# Altium project GreenHouse-hwd.PrjPcb (part 2 of 2)

## Sheet 11-LedIndicators.SchDoc
size A4; Author: Fabian Castaño; CompanyName: UdeA; Engineer: Fabian Castaño; Organization: Universidad de Antioquia; Address1: UdeA; Address2: Medellín; Address3: Antioquia; Address4: Colombia 050010; DocumentNumber: 12; SheetNumber: 12; SheetTotal: 12
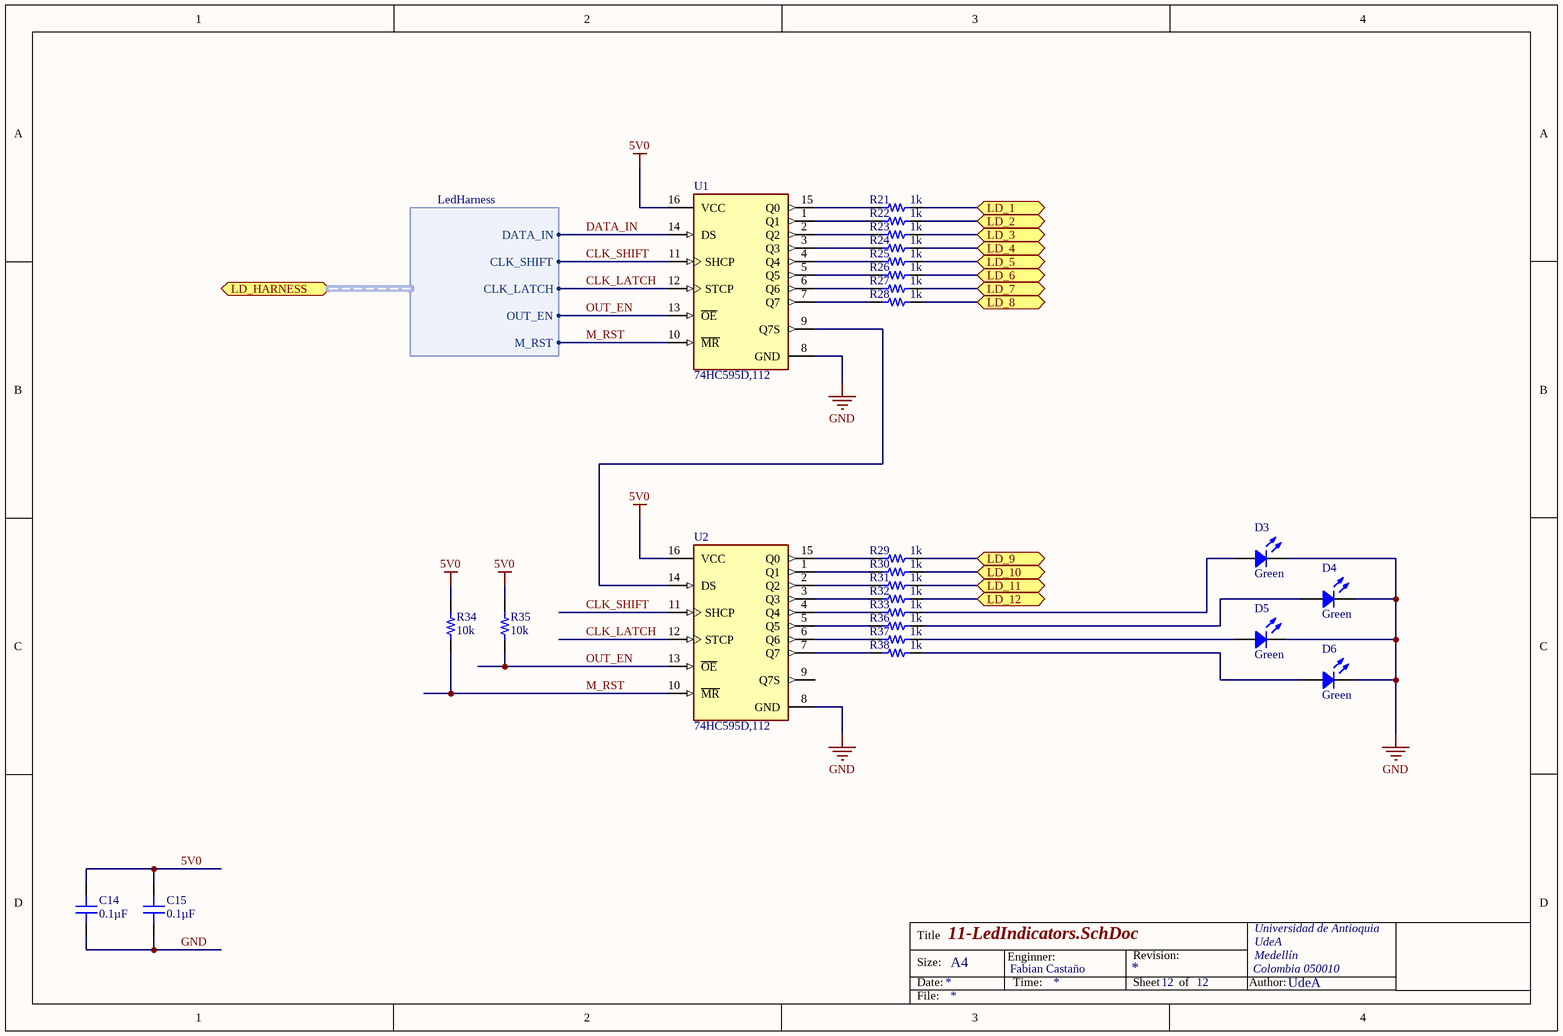
[diagram p11: 11-LedIndicators.SchDoc]

### Parts
C14  0.1µF  [CAP 0805_2012]
C15  0.1µF  [CAP 0805_2012]
D3  Green  [LED 0805_2012 YELLOW]
D4  Green  [LED 0805_2012 YELLOW]
D5  Green  [LED 0805_2012 YELLOW]
D6  Green  [LED 0805_2012 YELLOW]
R21  1k  [RES 0805_2012]
R22  1k  [RES 0805_2012]
R23  1k  [RES 0805_2012]
R24  1k  [RES 0805_2012]
R25  1k  [RES 0805_2012]
R26  1k  [RES 0805_2012]
R27  1k  [RES 0805_2012]
R28  1k  [RES 0805_2012]
R29  1k  [RES 0805_2012]
R30  1k  [RES 0805_2012]
R31  1k  [RES 0805_2012]
R32  1k  [RES 0805_2012]
R33  1k  [RES 0805_2012]
R34  10k  [RES 0805_2012]
R35  10k  [RES 0805_2012]
R36  1k  [RES 0805_2012]
R37  1k  [RES 0805_2012]
R38  1k  [RES 0805_2012]
U1  74HC595D,112  [FP-SOT109-1-MFG]
U2  74HC595D,112  [FP-SOT109-1-MFG]

### Ports
LD_1 (bidir), LD_2 (bidir), LD_3 (bidir), LD_4 (bidir), LD_5 (bidir), LD_6 (bidir), LD_7 (bidir), LD_8 (bidir), LD_9 (bidir), LD_10 (bidir), LD_11 (bidir), LD_12 (bidir), LD_HARNESS (harness LedHarness)

### Harnesses
LedHarness: DATA_IN, CLK_SHIFT, CLK_LATCH, OUT_EN, M_RST

### Nets
5V0: C14.2 C15.2 R34.2 R35.2 U1.16(VCC) U2.16(VCC)
GND: C14.1 C15.1 D3.2 D4.2 D5.2 D6.2 U1.8(GND) U2.8(GND)
CLK_LATCH: U1.12(STCP) U2.12(STCP) ; port LD_HARNESS.CLK_LATCH
CLK_SHIFT: U1.11(SHCP) U2.11(SHCP) ; port LD_HARNESS.CLK_SHIFT
DATA_IN: U1.14(DS) ; port LD_HARNESS.DATA_IN
M_RST: R34.1 U1.10(~{MR}) U2.10(~{MR}) ; port LD_HARNESS.M_RST
OUT_EN: R35.1 U1.13(~{OE}) U2.13(~{OE}) ; port LD_HARNESS.OUT_EN
NetD3_1: D3.1 R33.1
NetD4_1: D4.1 R36.1
NetD5_1: D5.1 R37.1
NetD6_1: D6.1 R38.1
NetJ1_10: R32.1 ; port LD_12
NetJ1_12: R31.1 ; port LD_11
NetJ2_10: R30.1 ; port LD_10
NetJ2_12: R29.1 ; port LD_9
NetJ3_10: R28.1 ; port LD_8
NetJ3_12: R27.1 ; port LD_7
NetJ5_10: R24.1 ; port LD_4
NetJ5_12: R23.1 ; port LD_3
NetJ6_10: R26.1 ; port LD_6
NetJ6_12: R25.1 ; port LD_5
NetJ8_10: R22.1 ; port LD_2
NetJ8_12: R21.1 ; port LD_1
NetR21_2: R21.2 U1.15(Q0)
NetR22_2: R22.2 U1.1(Q1)
NetR23_2: R23.2 U1.2(Q2)
NetR24_2: R24.2 U1.3(Q3)
NetR25_2: R25.2 U1.4(Q4)
NetR26_2: R26.2 U1.5(Q5)
NetR27_2: R27.2 U1.6(Q6)
NetR28_2: R28.2 U1.7(Q7)
NetR29_2: R29.2 U2.15(Q0)
NetR30_2: R30.2 U2.1(Q1)
NetR31_2: R31.2 U2.2(Q2)
NetR32_2: R32.2 U2.3(Q3)
NetR33_2: R33.2 U2.4(Q4)
NetR36_2: R36.2 U2.5(Q5)
NetR37_2: R37.2 U2.6(Q6)
NetR38_2: R38.2 U2.7(Q7)
NetU1_9: U1.9(Q7S) U2.14(DS)

Not connected (* = marked no-connect by the designer): U2 9(Q7S)

### Notes on the sheet
- Title
- Size:
- Date:
- A4
- Enginner:
- Time:
- Revision:
- Sheet
- of
- Author:
- File:

### Library data of the parts
C14 C15 = C0805C104M5RACAUTO: CAP CER 0.1UF 50V X7R 0805; Manufacturer: KEMET; Tolerance: ±20%; Part Number: C0805C104M5RACAUTO; Value: 0.1µF; Applications: Automotive, Bypass, Decoupling; Capacitance: 0.1µF; ComponentLink1Description: Datasheet; ComponentLink1URL: https://api.kemet.com/component-edge/download/datasheet/C0805C104M5RACAUTO.pdf; ComponentLink2Description: DigiKey Link; ComponentLink2URL: http://digikey.com/product-detail/en/kemet/C0805C104M5RACAUTO/399-12977-1-ND/5762259; Device Package: 0805 (2012 Metric); LastUpdated: 2/09/2020 01:04:42; Lifecycle Status: Active; Minimum Order: 1; Mounting Type: Surface Mount, MLCC; Operating Temperature: -55°C ~ 125°C; Package / Case: 0805 (2012 Metric); Packaging: TapeAndReel; PartId: 2568; Part Status: Active; Price: 0.02; Ratings: AEC-Q200; Series: SMD Auto X7R; Size / Dimension: 0.079" L x 0.049" W (2.00mm x 1.25mm); Supplier 1: DigiKey; Supplier Part Number 1: 399-12977-1-ND; Temperature Coefficient: X7R; Thickness (Max): 0.035" (0.88mm); Voltage - Rated: 50V
D3-D6 = APT2012SYCK: LED YELLOW CLEAR CHIP SMD; Manufacturer: Kingbright; Configuration: Standard; Current - Test: 20mA; Lens Color: Colorless; Lens Size: 1.30mm x 1.25mm; Lens Style: Rectangle with Flat Top; Millicandela Rating: 150mcd; Viewing Angle: 120°; Voltage - Forward (Vf) (Typ): 2V; Wavelength - Dominant: 590nm; Part Number: APT2012SYCK; Color: Yellow; ComponentLink1Description: Datasheet; ComponentLink1URL: http://www.kingbrightusa.com/images/catalog/SPEC/APT2012SYCK.pdf; ComponentLink2Description: DigiKey Link; ComponentLink2URL: https://www.digikey.com/en/products/detail/kingbright/APT2012SYCK/1747533; Device Package: 0805 (2012 Metric); Height (Max): 0.75mm; LastUpdated: 12/04/2022 10:52:50 p. m.; Lens Transparency: Clear; Lifecycle Status: Active; Minimum Order: 1; Mounting Type: Surface Mount; Package / Case: 0805 (2012 Metric); Packaging: TapeAndReel; PartId: 47; Part Status: Active; Price: 0.05; Series: -; Size / Dimension: 2.00mm L x 1.25mm W; Supplier 1: DigiKey; Supplier Part Number 1: 754-1134-1-ND; Supplier Device Package: Chip LED; Value: Green; Wavelength - Peak: 590nm
R21-R38 = RC0805FR-071K47L: RES SMD 1.47K OHM 1% 1/8W 0805; Manufacturer: Yageo; Power (Watts): 0.125W, 1/8W; Resistance: 1.47 kOhms; Temperature Coefficient: ±100ppm/°C; Part Number: RC0805FR-071K47L; ComponentLink1Description: Datasheet; ComponentLink1URL: https://www.yageo.com/upload/media/product/productsearch/datasheet/rchip/PYu-RC_Group_51_RoHS_L_10.pdf; ComponentLink2Description: DigiKey Link; ComponentLink2URL: http://digikey.com/product-detail/en/yageo/RC0805FR-071K47L/311-1.47KCRCT-ND/730440; Composition: Thick Film; Device Package: 0805 (2012 Metric); Features: Moisture Resistant; Height - Seated (Max): 0.024" (0.60mm); LastUpdated: 2/09/2020 01:14:46; Lifecycle Status: Active; Minimum Order: 1; Number of Terminations: 2; Operating Temperature: -55°C ~ 155°C; Package / Case: 0805 (2012 Metric); Packaging: CutTape; PartId: 44768; Part Status: Active; Price: 0.10; Series: RC; Size / Dimension: 0.079" L x 0.049" W (2.00mm x 1.25mm); Supplier 1: DigiKey; Supplier Part Number 1: 311-1.47KCRCT-ND; Supplier Device Package: 0805; Tolerance: ±1%
  R21-R33 R36-R38: Value: 1k
  R34 R35: Value: 10k
U1 U2 = CMP-14351-000003-1: IC SHIFT REGISTER 8BIT 16SOIC; Manufacturer: Nexperia; Propagation Delay: 16ns; Number Of Circuits: 1; Min Supply Voltage: 2V; Nominal Supply Current: 70mA; Standoff Height: 0.1mm; Frequency: 108MHz; Max Supply Voltage: 6V; Number Of Outputs: 8; Ambient Temperature Range Low: -40°C; ComponentLink2Description: Datasheet; Temperature Range High: +125°C; Temperature Range Low: -40°C; Octopart: https://octopart.com/74hc595d%2C112-nexperia-78737374; Category: IC; Automotive: No; Digikey Description: IC SHIFT REGISTER 8BIT 16SOIC; Footprint Url: https://assets.nexperia.com/documents/outline-drawing/SOT109-1.pdf; Device Class L3: Shift Registers; Package: SOT109-1; Device Class L2: Logic ICs; Lead Free: Yes; Device Class L1: Integrated Circuits (ICs); Manufacturer Part Number: 74HC595D,112; ComponentLink2URL: https://assets.nexperia.com/documents/data-sheet/74HC_HCT595.pdf; Height: 1.75mm; Ambient Temperature Range High: +125°C; RoHS: TRUE; Number Of Inputs: 1; Temperature: -40°C to +125°C; Mouser Description: 74HC(T)595 - 8-bit serial-in, serial or parallel-out shift register with output latches; 3-state

## Nets that join several sheets
3V3: 1-Microcontroller (MD1.62), 5-ThermoHygroSensor (R9.2)
5V0: 0-Hierarchy (6 pins), 1-Microcontroller (MD1.61 MD1.82 MD1.83), HS11 (R3_HS11.2), HS12 (R3_HS12.2), HS13 (R3_HS13.2), HS14 (R3_HS14.2), 4-LightSensor (R5.2), 5-ThermoHygroSensor (J5.7 R7.2 R8.2), 6-AirQualitySensor (R10.1 R10.2), 7-WeightSensor (C10.2 J6.7), T1W1 (R16_T1W1.2), T1W2 (R16_T1W2.2), 10-AdditionalSensors (C11.2 J8.7 R19.2 R20.2), 11-LedIndicators (6 pins)
GND: 0-Hierarchy (13 pins), 1-Microcontroller (5 pins), HS11 (R4_HS11.1), HS12 (R4_HS12.1), HS13 (R4_HS13.1), HS14 (R4_HS14.1), 4-LightSensor (R6.1), 5-ThermoHygroSensor (J5.6 J5.8 J5.9 J5.11), 6-AirQualitySensor (C7.1 R11.1 R12.1 R12.2), VALV1 (5 pins), VALV2 (5 pins), 7-WeightSensor (5 pins), 10-AdditionalSensors (C11.1 J8.8 J8.9 J8.11), 11-LedIndicators (8 pins)
V_Valve: 0-Hierarchy (J4.1 R1.1 R2.1), VALV1 (C8_VALV1.2 C9_VALV1.1 D1_VALV1.2 R13_VALV1.2), VALV2 (C8_VALV2.2 C9_VALV2.1 D1_VALV2.2 R13_VALV2.2)
VIN: 0-Hierarchy (R1.2 R2.2), 1-Microcontroller (MD1.58)
AQS_1: 0-Hierarchy (J2.4 J2.5), 1-Microcontroller (MD1.69), 6-AirQualitySensor (C7.2 R11.2)
CLK_LATCH: 1-Microcontroller (MD1.32), 11-LedIndicators (U1.12 U2.12)
CLK_SHIFT: 1-Microcontroller (MD1.31), 11-LedIndicators (U1.11 U2.11)
DATA_IN: 1-Microcontroller (MD1.30), 11-LedIndicators (U1.14)
FS_1: 1-Microcontroller (MD1.9), FS11 (R18_FS11.1)
FS_2: 1-Microcontroller (MD1.25), FS12 (R18_FS12.1)
H_IN_N_1: 0-Hierarchy (J1.2), HS11 (C5_HS11.1 R4_HS11.2)
H_IN_N_2: 0-Hierarchy (J1.6), HS12 (C5_HS12.1 R4_HS12.2)
H_IN_N_3: 0-Hierarchy (J1.4), HS13 (C5_HS13.1 R4_HS13.2)
H_IN_N_4: 0-Hierarchy (J1.8), HS14 (C5_HS14.1 R4_HS14.2)
H_IN_P_1: 0-Hierarchy (J1.1), 1-Microcontroller (MD1.66), HS11 (C5_HS11.2 R3_HS11.1)
H_IN_P_2: 0-Hierarchy (J1.3), 1-Microcontroller (MD1.67), HS12 (C5_HS12.2 R3_HS12.1)
H_IN_P_3: 0-Hierarchy (J1.5), 1-Microcontroller (MD1.72), HS13 (C5_HS13.2 R3_HS13.1)
H_IN_P_4: 0-Hierarchy (J1.7), 1-Microcontroller (MD1.73), HS14 (C5_HS14.2 R3_HS14.1)
HALL_E_1: 0-Hierarchy (J3.5), FS11 (R18_FS11.2)
HALL_E_2: 0-Hierarchy (J3.4), FS12 (R18_FS12.2)
L_IN_N: 0-Hierarchy (J2.2), 4-LightSensor (C6.1 R6.2)
L_IN_P: 0-Hierarchy (J2.1), 1-Microcontroller (MD1.68), 4-LightSensor (C6.2 R5.1)
M_RST: 1-Microcontroller (MD1.34), 11-LedIndicators (R34.1 U1.10 U2.10)
NetJ1_10: 0-Hierarchy (J1.10), 11-LedIndicators (R32.1)
NetJ1_12: 0-Hierarchy (J1.12), 11-LedIndicators (R31.1)
NetJ2_10: 0-Hierarchy (J2.10), 11-LedIndicators (R30.1)
NetJ2_12: 0-Hierarchy (J2.12), 11-LedIndicators (R29.1)
NetJ3_10: 0-Hierarchy (J3.10), 11-LedIndicators (R28.1)
NetJ3_12: 0-Hierarchy (J3.12), 11-LedIndicators (R27.1)
NetJ5_4: 1-Microcontroller (MD1.56), 5-ThermoHygroSensor (J5.4)
NetJ5_5: 1-Microcontroller (MD1.57), 5-ThermoHygroSensor (J5.5)
NetJ5_10: 5-ThermoHygroSensor (J5.10), 11-LedIndicators (R24.1)
NetJ5_12: 5-ThermoHygroSensor (J5.12), 11-LedIndicators (R23.1)
NetJ6_10: 7-WeightSensor (J6.10), 11-LedIndicators (R26.1)
NetJ6_12: 7-WeightSensor (J6.12), 11-LedIndicators (R25.1)
NetJ8_1: 1-Microcontroller (MD1.28), 10-AdditionalSensors (J8.1)
NetJ8_2: 1-Microcontroller (MD1.27), 10-AdditionalSensors (J8.2)
NetJ8_3: 1-Microcontroller (MD1.26), 10-AdditionalSensors (J8.3)
NetJ8_4: 1-Microcontroller (MD1.24), 10-AdditionalSensors (J8.4 R19.1)
NetJ8_5: 1-Microcontroller (MD1.23), 10-AdditionalSensors (J8.5 R20.1)
NetJ8_6: 1-Microcontroller (MD1.74), 10-AdditionalSensors (J8.6)
NetJ8_10: 10-AdditionalSensors (J8.10), 11-LedIndicators (R22.1)
NetJ8_12: 10-AdditionalSensors (J8.12), 11-LedIndicators (R21.1)
ONE_WIRE_1: 0-Hierarchy (J2.3), T1W1 (R17_T1W1.2)
ONE_WIRE_2: 0-Hierarchy (J2.6), T1W2 (R17_T1W2.2)
OUT_EN: 1-Microcontroller (MD1.33), 11-LedIndicators (R35.1 U1.13 U2.13)
T_1W_1: 1-Microcontroller (MD1.2), T1W1 (R16_T1W1.1 R17_T1W1.1)
T_1W_2: 1-Microcontroller (MD1.3), T1W2 (R16_T1W2.1 R17_T1W2.1)
THS_1: 1-Microcontroller (MD1.4), 5-ThermoHygroSensor (J5.1 J5.2 R7.1)
VALV_1: 1-Microcontroller (MD1.8), VALV1 (D2_VALV1.1 Q1_VALV1.1 R14_VALV1.2)
VALV_2: 1-Microcontroller (MD1.22), VALV2 (D2_VALV2.1 Q1_VALV2.1 R14_VALV2.2)
VALVE_N_1: 0-Hierarchy (J3.6), VALV1 (D1_VALV1.1 Q1_VALV1.2)
VALVE_N_2: 0-Hierarchy (J3.2), VALV2 (D1_VALV2.1 Q1_VALV2.2)
VALVE_P_1: 0-Hierarchy (J3.3), VALV1 (R13_VALV1.1)
VALVE_P_2: 0-Hierarchy (J3.1), VALV2 (R13_VALV2.1)
W_DOUT: 1-Microcontroller (MD1.6), 7-WeightSensor (J6.1)
W_SCK: 1-Microcontroller (MD1.7), 7-WeightSensor (J6.2)